# Altium project Do_an_2.PrjPCB
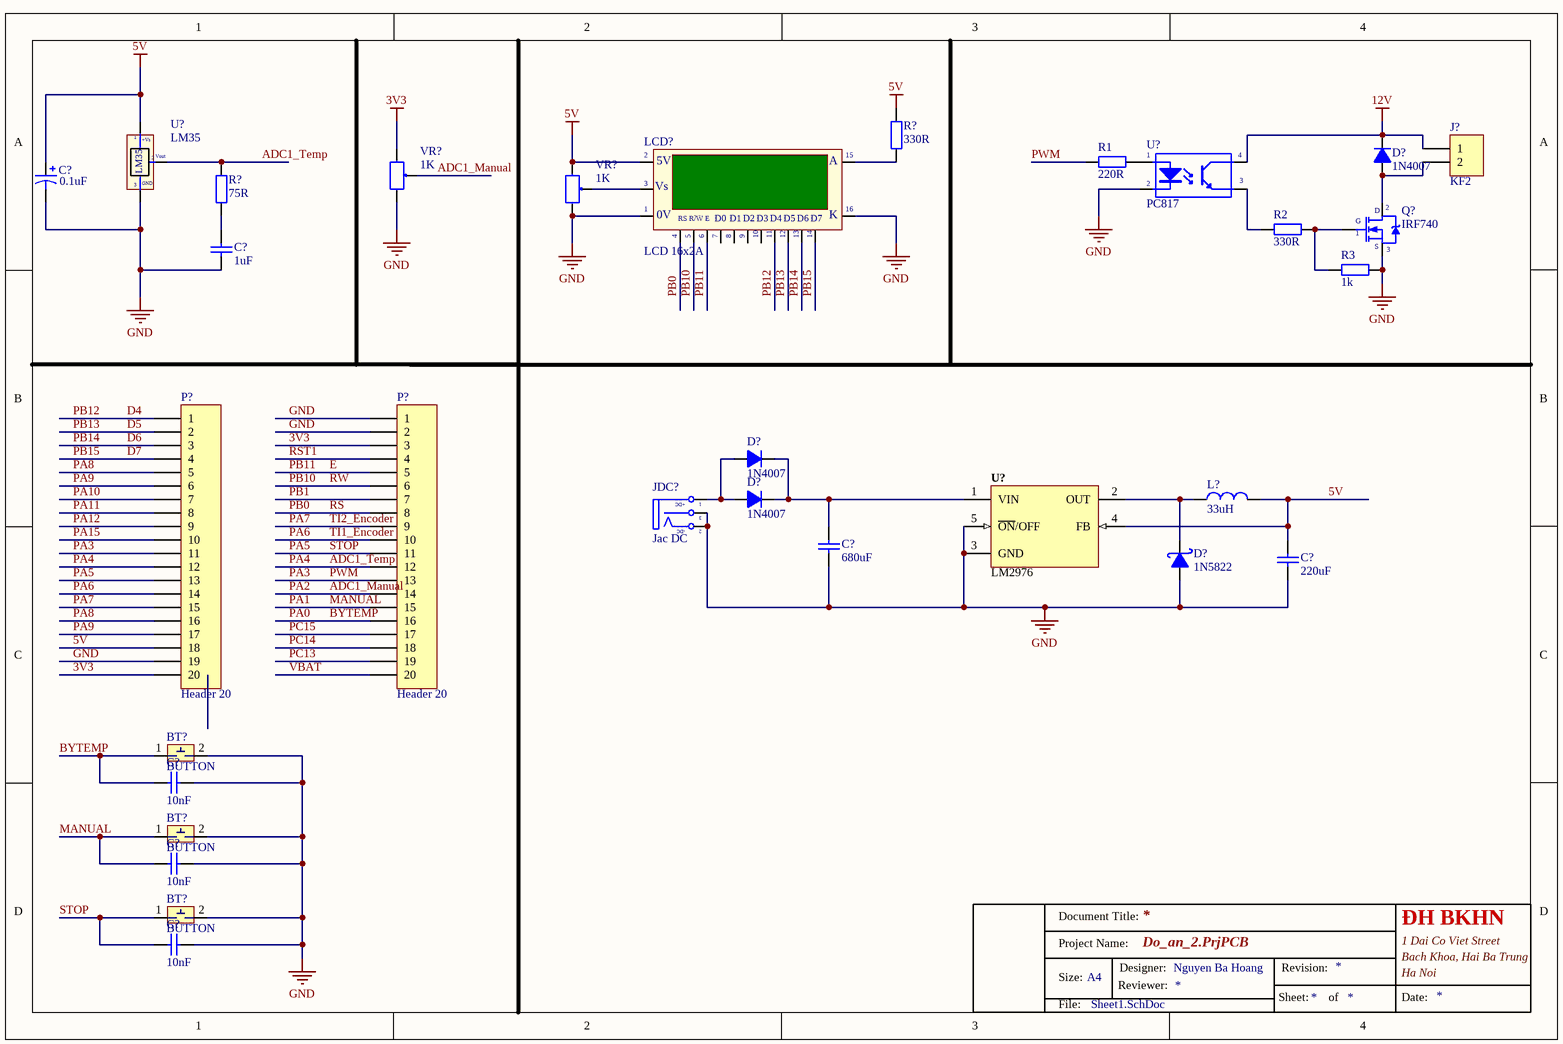
[diagram p0: Sheet1.SchDoc]
1 sheet, 31 parts. Net scope: global (net labels, ports and power ports of the same name join across sheets).
Board file: PCB1.PcbDoc

## Sheet Sheet1.SchDoc
size A4

### Parts
(Parts that share a designator on the sheet are numbered #1, #2 ... from top to bottom, then left to right.)
BT?#1  BUTTON  [button 4 pin]
BT?#2  BUTTON  [button 4 pin]
BT?#3  BUTTON  [button 4 pin]
C?#1  0.1uF  [C5mm]
C?#2  1uF  [CN3]
C?#3  680uF  [CN3]
C?#4  220uF  [CN3]
C?#5  10nF  [CN3]
C?#6  10nF  [CN3]
C?#7  10nF  [CN3]
D?#1  1N4007  [D1A]
D?#2  1N4007  [D1A]
D?#3  1N4007  [D1A]
D?#4  1N5822  [D5A]
J?  KF2  [KF2-3.5]
JDC?  Jac DC  [DC-IN]
L?  33uH  [L/0.4]
LCD?  LCD 16x2A  [LCD16X2]
P?#1  Header 20  [HDR1X20]
P?#2  Header 20  [HDR1X20]
Q?  IRF740  [QTO-220]
R1  220R  [R1/4W]
R2  330R  [R1/4W]
R3  1k  [R1/4W]
R?#1  330R  [R1/4W]
R?#2  75R  [R1/4W]
U?#1  LM35  [QTO-92]
U?#2  PC817  [DIP4/W0.3]
U?#3  LM2976  [TO263]
VR?#1  1K  [Bien Tro Vi Chinh Dung]
VR?#2  1K  [Bien Tro Vi Chinh Dung]

### Nets
3V3: P?#1.20 P?#2.3 VR?#1.1
5V: C?#1.1 C?#4.2 L?.2 LCD?.2(VDD) P?#1.18 R?#1.2 U?#1.1(+Vs) U?#3.4(FB) VR?#2.1
12V: D?#1.2(K) J?.1 U?#2.4(C)
GND: BT?#1.2 BT?#2.2 BT?#3.2 C?#1.2 C?#2.1 C?#3.1 C?#4.1 C?#5.1 C?#6.1 C?#7.1 D?#4.1(A) JDC?.2(TN) JDC?.3(S) LCD?.1(GND) LCD?.16(K) P?#1.19 P?#2.1 P?#2.2 Q?.3(S) R3.2 U?#1.3(-) U?#2.2(K) U?#3.3(GND) U?#3.5(~{ON}/OFF) VR?#1.3 VR?#2.3
ADC1_Manual: P?#2.14 VR?#1.2  [also labelled PA2]
ADC1_Temp: P?#1.12 P?#2.12 R?#2.2 U?#1.2(Vout)  [also labelled PA4]
BYTEMP: BT?#1.1 C?#5.2 P?#2.16  [also labelled PA0]
D4: LCD?.11(D4) P?#1.1  [also labelled PB12]
D5: LCD?.12(D5) P?#1.2  [also labelled PB13]
D6: LCD?.13(D6) P?#1.3  [also labelled PB14]
D7: LCD?.14(D7) P?#1.4  [also labelled PB15]
E: LCD?.6(~{EN}) P?#2.5  [also labelled PB11]
MANUAL: BT?#2.1 C?#6.2 P?#2.15  [also labelled PA1]
PA3: P?#1.11 P?#2.13 R1.1  [also labelled PWM]
PA5: BT?#3.1 C?#7.2 P?#1.13 P?#2.11  [also labelled STOP]
PA6: P?#1.14 P?#2.10  [also labelled TI1_Encoder]
PA7: P?#1.15 P?#2.9  [also labelled TI2_Encoder]
PA8: P?#1.5 P?#1.16
PA9: P?#1.6 P?#1.17
PA10: P?#1.7
PA11: P?#1.8
PA12: P?#1.9
PA15: P?#1.10
PB0: LCD?.4(RS) P?#2.8  [also labelled RS]
PB1: P?#2.7
PB10: LCD?.5(R/~{W}) P?#2.6  [also labelled RW]
PC13: P?#2.19
PC14: P?#2.18
PC15: P?#2.17
RST1: P?#2.4
VBAT: P?#2.20
NetC?#2_2: C?#2.2 R?#2.1
NetC?#3_2: C?#3.2 D?#2.2(K) D?#3.2(K) U?#3.1(VIN)
NetD?#1_1: D?#1.1(A) J?.2 Q?.2(D)
NetD?#2_1: D?#2.1(A) D?#3.1(A) JDC?.1(T)
NetD?#4_2: D?#4.2(K) L?.1 U?#3.2(OUT)
NetLCD?_3: LCD?.3(VEE) VR?#2.2
NetLCD?_15: LCD?.15(A) R?#1.1
NetQ?_1: Q?.1(G) R2.2 R3.1
NetR1_2: R1.2 U?#2.1(A)
NetR2_1: R2.1 U?#2.3(E)

Not connected (* = marked no-connect by the designer): LCD? 7(D0) 8(D1) 9(D2) 10(D3)

### Notes on the sheet
- Document Title:
- ĐH BKHN
- Project Name:
- Size:
- A4
- Reviewer:
- Designer:
- Nguyen Ba Hoang
- Revision:
- 1 Dai Co Viet Street
- Bach Khoa, Hai Ba Trung
- Ha Noi
- File:
- Sheet:
- of
- Date:
- (in symbol DCIN) +DC; -DC
- (in symbol LCD16x2A) 5V; Vs; |; 0V; R/W; E
- (in symbol LM35) GND

### Library data of the parts
BT?#1-BT?#3 = BUTTON 4 PIN
C?#1 = Cap Pol 5mm: Polarized Capacitor (Axial); Published: 8-Jun-2000; LatestRevisionDate: 17-Jul-2002; LatestRevisionNote: Re-released for DXP Platform.; PackageReference: POLAR0.8; Publisher: Altium Limited
C?#2-C?#7 = CAP 102 2KV: Capacitor (Semiconductor SIM Model); Value: 0.1uF; Published: 8-Jun-2000; LatestRevisionDate: 17-Jul-2002; LatestRevisionNote: Re-released for DXP Platform.; PackageReference: C1206; Publisher: Altium Limited
D?#1-D?#3 = D1A: Diode 1A; Value: 1N4007
D?#4 = 1N5822: Schottky Rectifiers; Value: Diode c?m 1N5408
J? = KF2: Manufacturer: Würth Elektronik eiSos GmbH; partNo: 691103110002; ComponentLink1 Description: Manufacturer; ComponentLink2 Description: Datasheet; NoPins: 2; Created Date: 29 October 2013; ComponentLink1URL: http://www.we-online.com; ComponentLink2URL: http://katalog.we-online.de/em/datasheet/6911031100xx.pdf; Created by: Karrer Zheng
JDC? = DCIN: Jac DC input; Value: Jac DC
L? = Inductor: Value: 150 mH
LCD? = LCD16x2A: LCD dipslay 16 char, 2 line; Value: LCD16x2A
P?#1 P?#2 = Header 20: Header, 20-Pin; LatestRevisionDate: 17-Jul-2002; LatestRevisionNote: Re-released for DXP Platform.; Publisher: Altium Limited
Q? = IRF840: MOSFET N - CHANNEL 500V - 0.75 - 8A - TO-220; Value: IRF840
R1-R3 R?#1 R?#2 = R1/4W: Resistor 1/4W; Value: R1/4W - 1K
U?#1 = LM35: Teminal; Value: LM35
U?#2 = PC817: Single Opto; Value: PC817
U?#3 = LM2596: Max Input Voltage: 12 V; Max Output Current: 3 (6.0 peak) A; Max Output Voltage: mV; Category: IC-Power; Min Input Voltage: mV; Min Output Voltage: mV; Mounting Technology: Surface Mount; Status: Unreleased; Supply Voltage: mV; Temperature Range: -40 to +125 degC
VR?#1 VR?#2 = Bien Tro Tinh Chinh 1K Dung: Cắm; Don_Vi: Con; Ten_Linh_Kien: Biến Trở VR 102-1K 3296W; Ma_Hang: MH003234; Kieu_Chan: *; Chung_Loai: Cắm